# Altium schematic sheet MUX.SchDoc
size A; SheetNumber: 1; SheetTotal: 1
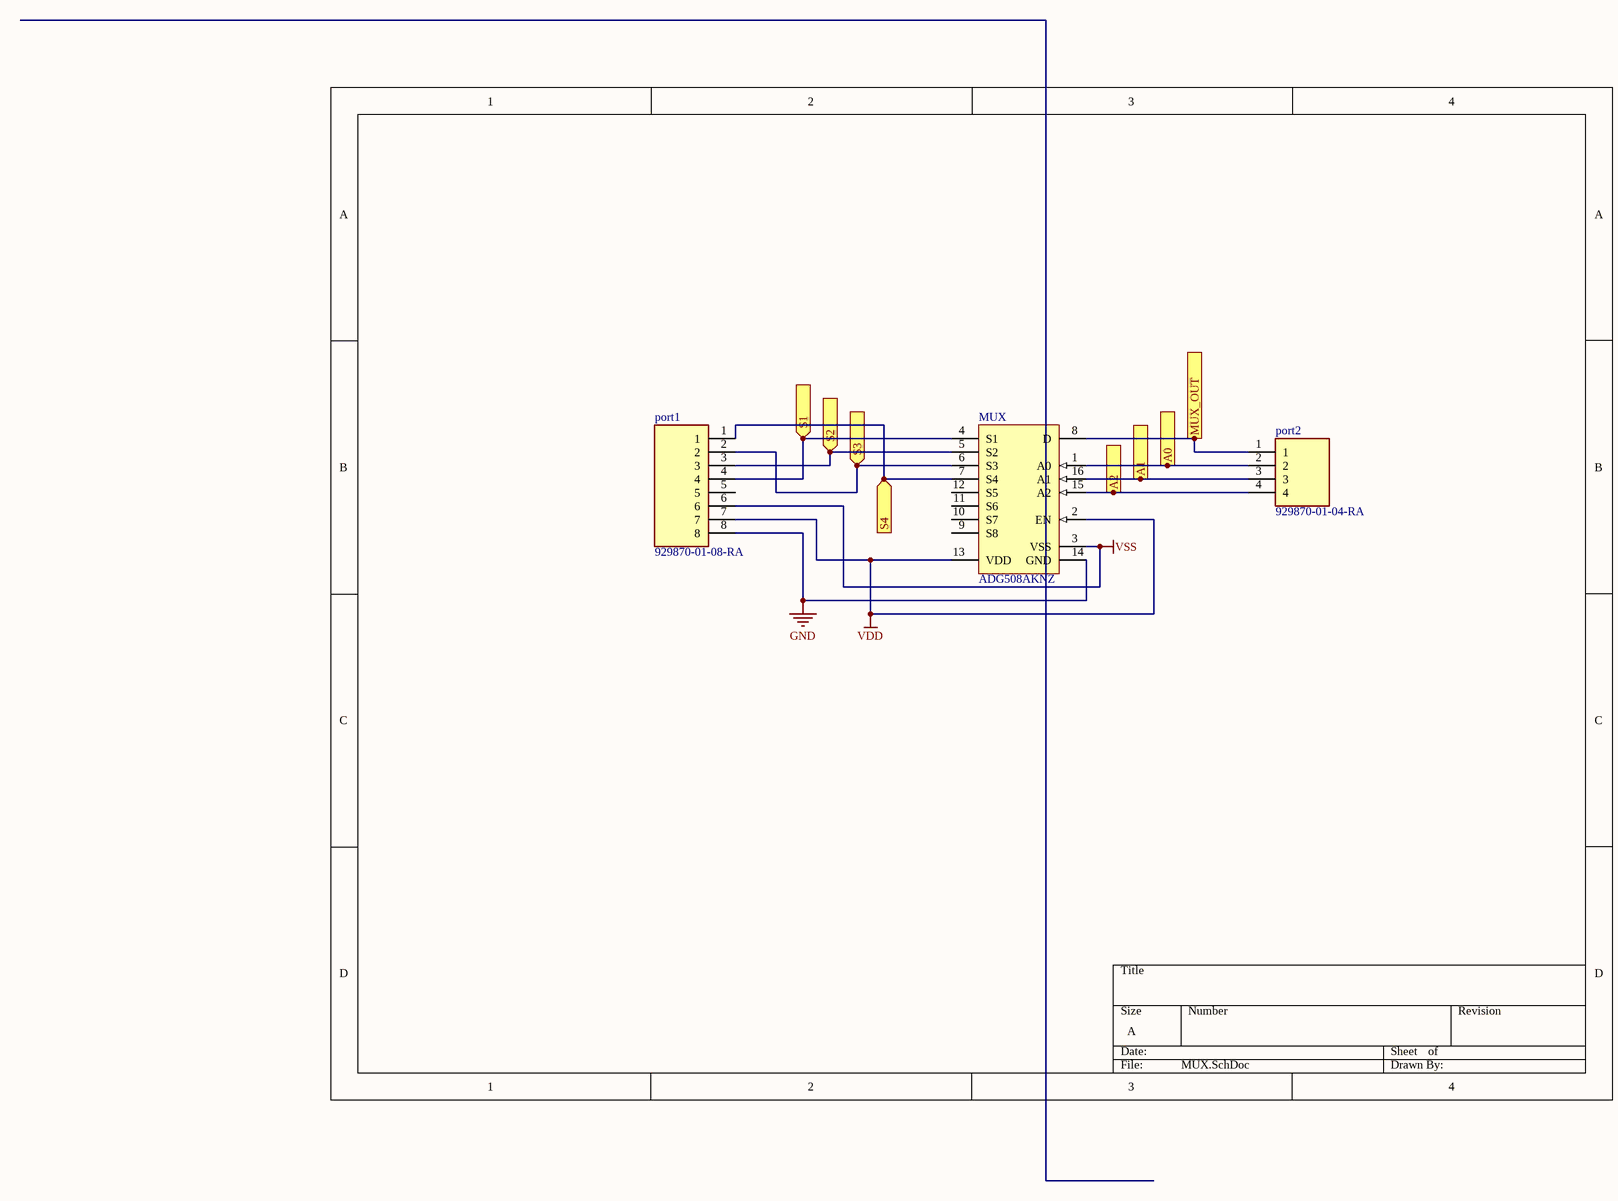
[diagram p0: MUX.SchDoc]

## Parts
MUX  ADG508AKNZ  [ADI-N-16]
port1  929870-01-08-RA  [RHDR8W64P0X254_1X8_2032X254X380P]
port2  929870-01-04-RA  [RHDR4W76P0X254_1X4_1016X254X826P]

## Ports
A0 (in), A1 (in), A2 (in), MUX_OUT (out), S1 (in), S2 (in), S3 (in), S4 (in)

## Nets
GND: MUX.14(GND) port1.8
VDD: MUX.2(EN) MUX.13(VDD) port1.7
VSS: MUX.3(VSS) port1.6
A0: MUX.1(A0) port2.2 ; port A0
A1: MUX.16(A1) port2.3 ; port A1
A2: MUX.15(A2) port2.4 ; port A2
MUX_OUT: MUX.8(D) port2.1 ; port MUX_OUT
S1: MUX.4(S1) port1.4 ; port S1
S2: MUX.5(S2) port1.3 ; port S2
S3: MUX.6(S3) port1.2 ; port S3
S4: MUX.7(S4) port1.1 ; port S4

Not connected (* = marked no-connect by the designer): MUX 9(S8) 10(S7) 11(S6) 12(S5); port1 5

## Library data of the parts
MUX = CMP-0793-00029-1: CMOS 8-Channel Analog Multiplexer, 280 Ohm / 500 Ohm Ron, 16-pin DIP (N-16), Tube; Manufacturer: Analog Devices; t transition (s): 200n; Ron (ohms): 280; Max Analog Signal Range: Vss to Vdd; Packing: Tube; Code_JEDEC: MS-001; Mounting Technology: Through Hole; ComponentLink1Description: Manufacturer URL; ComponentLink2Description: Datasheet; ComponentLink3URL: http://www.analog.com/static/imported-files/packages/44768431550332N_16.pdf; PackageReference: N-16; ComponentLink1URL: http://www.analog.com/en/index.html; ComponentLink2URL: http://www.analog.com/static/imported-files/data_sheets/ADG508A_509A.pdf; DatasheetVersion: Rev. D; PackageVersion: 070706-A, 07/2006; ComponentLink3Description: Package Specification; PackageDescription: 16-Pin Plastic Dual In-Line Package, Row spacing 7.62 mm, Pitch 2.54 mm; PartNumber: ADG508AKNZ
port1 = 929870-01-08-RA: Connector; Manufacturer_Name: 3M; Datasheet Link: https://componentsearchengine.com/Datasheets/2/929870-01-08-RA.pdf; Height: 3.8mm; Manufacturer_Part_Number: 929870-01-08-RA; Mouser Part Number: 517-929870-01-08-RA; Mouser Price/Stock: https://www.mouser.co.uk/ProductDetail/3M-Electronic-Solutions-Division/929870-01-08-RA?qs=neFkstNq%252B6FsuK7vJEiMKg%3D%3D; Arrow Part Number: 929870-01-08-RA; Arrow Price/Stock: https://www.arrow.com/en/products/929870-01-08-ra/3m?utm_currency=USD&region=nac
port2 = 929870-01-04-RA: Connector; Manufacturer_Name: 3M; Datasheet Link: https://componentsearchengine.com/Datasheets/2/929870-01-04-RA.pdf; Height: 8.26mm; Manufacturer_Part_Number: 929870-01-04-RA; Mouser Part Number: 517-929870-01-04-RA; Mouser Price/Stock: https://www.mouser.co.uk/ProductDetail/3M-Electronic-Solutions-Division/929870-01-04-RA?qs=neFkstNq%252B6GPZEKactAgTg%3D%3D; Arrow Part Number: 929870-01-04-RA; Arrow Price/Stock: https://www.arrow.com/en/products/929870-01-04-ra/3m